# EAGLE schematic ArduTS-v1 (EAGLE 5.07)
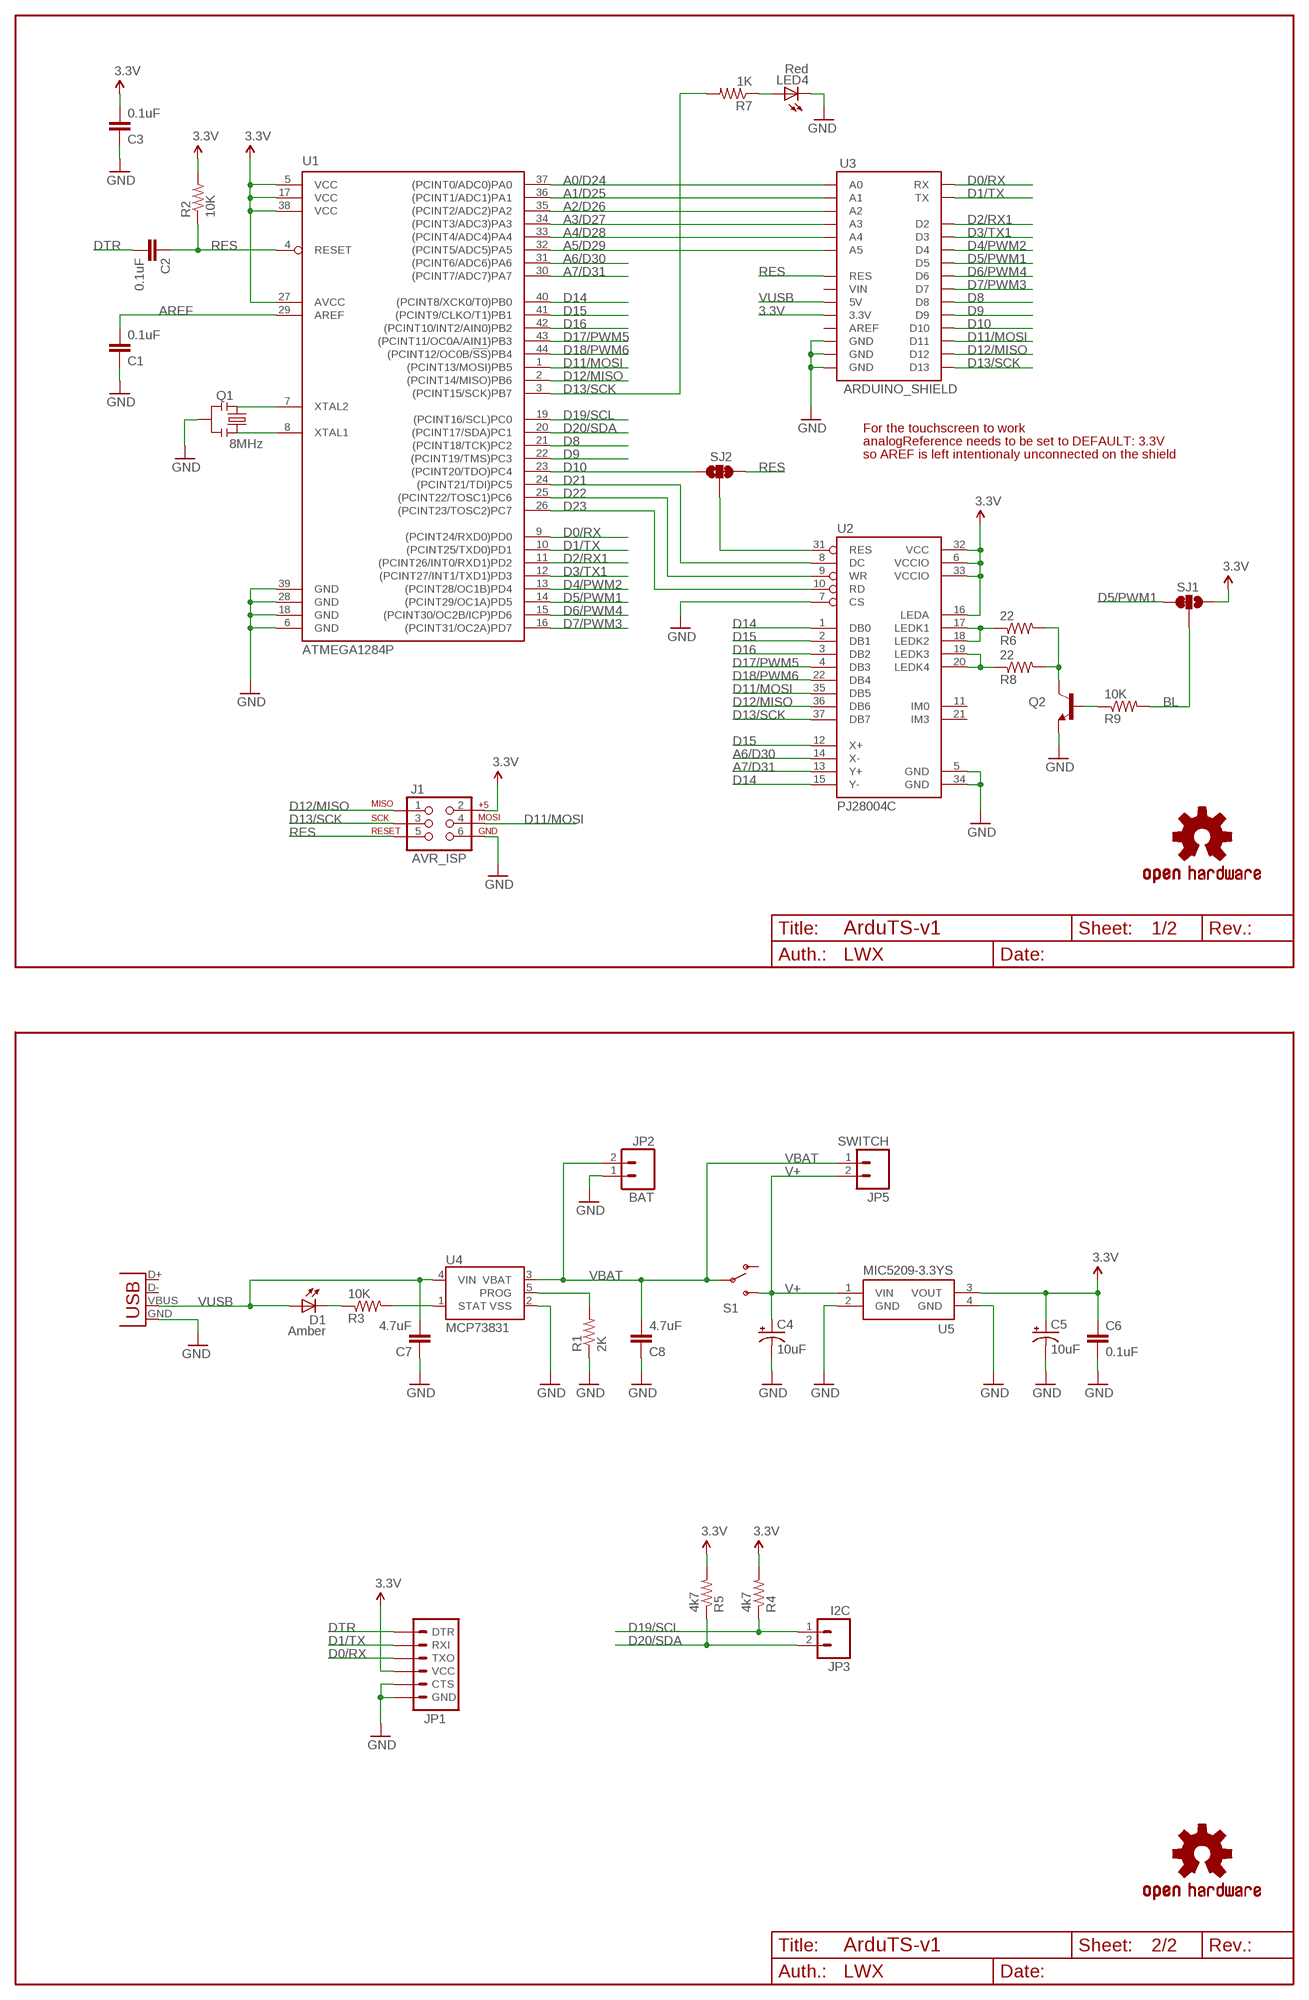
[diagram p0: schematic, sheet 1]

## Parts
C1  0.1uF  CAP0805  [0805]
C2  0.1uF  CAP0805  [0805]
C3  0.1uF  CAP0805  [0805]
C4  10uF  CAP_POL1206  [EIA3216]
C5  10uF  CAP_POL1206  [EIA3216]
C6  0.1uF  CAP0805  [0805]
C7  4.7uF  CAP0805  [0805]
C8  4.7uF  CAP0805  [0805]
D1  Amber  LED  [LED]
J1  AVR_ISP  AVR_SPI_PRG_6PTH  [2X3]
JP1  ARDUINO_SERIAL_PROGRAMPTH  [1X06]
JP2  BAT  M02-JST-2MM-SMT  [JST-2-SMD]
JP3  I2C  M02  [1X02]
JP5  SWITCH  M02  [1X02]
LED4  Red  LED805  [LED-0805]
Q1  8MHz  RESONATORSMD  [RESONATOR-SMD]
Q2  TRANSISTOR_NPNSOT23-3  [SOT23-3]
R1  2K  RESISTOR0805-RES  [0805]
R2  10K  RESISTOR0805-RES  [0805]
R3  10K  RESISTOR0805-RES  [0805]
R4  4k7  RESISTOR0805-RES  [0805]
R5  4k7  RESISTOR0805-RES  [0805]
R6  22  RESISTOR0805-RES  [0805]
R7  1K  RESISTOR0805-RES  [0805]
R8  22  RESISTOR0805-RES  [0805]
R9  10K  RESISTOR0805-RES  [0805]
S1  SWITCH-SPST-SMD-A  [SWITCH-SPST-SMD-A]
SJ1  SJ_2WAYS_1-2  [SJ_2WAYS_1-2_S]
SJ2  SJ_2WAYS_1-2  [SJ_2WAYS_1-2_S]
U1  ATMEGA1284P  ATMEGA324A  [TQFP44]
U2  PJ28004C  [PJ28004C]
U3  ARDUINO_SHIELD  [ARDUINO_SHIELD]
U4  MCP73831  [SOT23-5]
U5  MIC5209-3.3YS  MIC5209  [SOT223]
U$3  OSHW-LOGOM  [OSHW-LOGO-M]
U$5  OSHW-LOGOM  [OSHW-LOGO-M]
X1  USBSMD  [USB-MINIB]

## Nets
3.3V: C3.2 C5.A(+) C6.1 J1.2 JP1.4(VCC) R2.2 R4.2 R5.2 SJ1.3 U1.5(VCC) U1.17(VCC) U1.27(AVCC) U1.38(VCC) U2.6(VCCIO) U2.16(LEDA) U2.32(VCC) U2.33(VCCIO) U3.3.3V U5.3(VOUT)
A0/D24: U1.37((PCINT0/ADC0)PA0) U3.A0
A1/D25: U1.36((PCINT1/ADC1)PA1) U3.A1
A2/D26: U1.35((PCINT2/ADC2)PA2) U3.A2
A3/D27: U1.34((PCINT3/ADC3)PA3) U3.A3
A4/D28: U1.33((PCINT4/ADC4)PA4) U3.A4
A5/D29: U1.32((PCINT5/ADC5)PA5) U3.A5
A6/D30: U1.31((PCINT6/ADC6)PA6) U2.14(X-)
A7/D31: U1.30((PCINT7/ADC7)PA7) U2.13(Y+)
AREF: C1.2 U1.29(AREF)
BL: R9.2 SJ1.2
D0/RX: JP1.3(TXO) U1.9((PCINT24/RXD0)PD0) U3.RX
D1/TX: JP1.2(RXI) U1.10((PCINT25/TXD0)PD1) U3.TX
D2/RX1: U1.11((PCINT26/INT0/RXD1)PD2) U3.D2
D3/TX1: U1.12((PCINT27/INT1/TXD1)PD3) U3.D3
D4/PWM2: U1.13((PCINT28/OC1B)PD4) U3.D4
D5/PWM1: SJ1.1 U1.14((PCINT29/OC1A)PD5) U3.D5
D6/PWM4: U1.15((PCINT30/OC2B/ICP)PD6) U3.D6
D7/PWM3: U1.16((PCINT31/OC2A)PD7) U3.D7
D8: U1.21((PCINT18/TCK)PC2) U3.D8
D9: U1.22((PCINT19/TMS)PC3) U3.D9
D10: SJ2.3 U1.23((PCINT20/TDO)PC4) U3.D10
D11/MOSI: J1.4 U1.1((PCINT13/MOSI)PB5) U2.35(DB5) U3.D11
D12/MISO: J1.1 U1.2((PCINT14/MISO)PB6) U2.36(DB6) U3.D12
D13/SCK: J1.3 R7.2 U1.3((PCINT15/SCK)PB7) U2.37(DB7) U3.D13
D14: U1.40((PCINT8/XCK0/T0)PB0) U2.1(DB0) U2.15(Y-)
D15: U1.41((PCINT9/CLKO/T1)PB1) U2.2(DB1) U2.12(X+)
D16: U1.42((PCINT10/INT2/AIN0)PB2) U2.3(DB2)
D17/PWM5: U1.43((PCINT11/OC0A/AIN1)PB3) U2.4(DB3)
D18/PWM6: U1.44((PCINT12/OC0B/!SS!)PB4) U2.22(DB4)
D19/SCL: JP3.1 R4.1 U1.19((PCINT16/SCL)PC0)
D20/SDA: JP3.2 R5.1 U1.20((PCINT17/SDA)PC1)
D21: U1.24((PCINT21/TDI)PC5) U2.8(DC)
D22: U1.25((PCINT22/TOSC1)PC6) U2.9(WR)
D23: U1.26((PCINT23/TOSC2)PC7) U2.10(RD)
DTR: C2.2 JP1.1(DTR)
GND [vcc]: C1.1 C3.1 C4.C(-) C5.C(-) C6.2 C7.1 C8.1 J1.6 JP1.5(CTS) JP1.6(GND) JP2.1 LED4.2(C) Q1.2 Q2.2(E) R1.1 U1.6(GND) U1.18(GND) U1.28(GND) U1.39(GND) U2.5(GND) U2.7(CS) U2.34(GND) U3.GND@0(GND) U3.GND@1(GND) U3.GND@2(GND) U4.2(VSS) U5.2(GND) U5.4(GND) X1.GND
N$1: Q1.1 U1.8(XTAL1)
N$2: Q1.3 U1.7(XTAL2)
N$3: SJ2.2 U2.31(RES)
N$4: Q2.1(B) R9.1
N$5: LED4.1(A) R7.1
N$7: Q2.3(C) R6.2 R8.2
N$8: D1.C1(C) R3.1
N$12: R3.2 U4.1(STAT)
N$13: R1.2 U4.5(PROG)
N$25: R8.1 U2.19(LEDK3) U2.20(LEDK4)
N$32: R6.1 U2.17(LEDK1) U2.18(LEDK2)
RES: C2.1 J1.5 R2.1 SJ2.1 U1.4(RESET) U3.RES
V+: C4.A(+) JP5.2 S1.3(S) U5.1(VIN)
VBAT: C8.2 JP2.2 JP5.1 S1.2(P) U4.3(VBAT)
VUSB: C7.2 D1.A1(A) U3.5V U4.4(VIN) X1.VBUS
Unconnected: S1.1(O) U2.11(IM0) U2.21(IM3) U3.AREF U3.VIN X1.D+ X1.D-

## Notes on the sheet
- For the touchscreen to work
- analogReference needs to be set to DEFAULT: 3.3V
- so AREF is left intentionaly unconnected on the shield
- 1/2
- LWX
- 2/2
- LWX

## Library data of the parts
C1-C3 C6-C8 = SparkFun:CAP: Capacitor Standard 0603 ceramic capacitor, and 0.1" leaded capacitor.
C4 C5 = SparkFun:CAP_POL: Capacitor Polarized These are standard SMD and PTH capacitors. Normally 10uF, 47uF, and 100uF in electrolytic and tantalum varieties. Always verify the external diameter of the through hole cap, it varies with capacity, voltage, and manufacturer. The EIA devices should be standard.
D1 LED4 = wibauxl:LED
J1 = SparkFun:AVR_SPI_PRG_6: AVR ISP 6 Pin This is the reduced ISP connector for AVR programming. Common on Arduino. This footprint will take up less PCB space and can be used with a 10-pin to 6-pin adapter such as SKU: BOB-08508
JP1 = SparkFun:ARDUINO_SERIAL_PROGRAM
JP2 = SparkFun:M02: Header 2 Standard 2-pin 0.1" header. Use with straight break away headers (SKU : PRT-00116), right angle break away headers (PRT-00553), swiss pins (PRT-00743), machine pins (PRT-00117), and female headers (PRT-00115). Molex polarized connector foot print use with SKU : PRT-08233 with associated crimp pins and housings.
JP3 JP5 = wibauxl:M02
Q1 = SparkFun:RESONATOR: Resonator Small SMD resonator. This is the itty bitty 10/20MHz resonators with built in caps. CSTCE10M0G55 and CSTCE20M0V53. Footprint has been reviewed closely but hasn't been tested yet.
Q2 = SparkFun:TRANSISTOR_NPN: Transistor NPN BJT configuration in SOT23 package. MMBT2222 is the common NPN we use. Double check BCE configuration again layout.
R1-R9 = SparkFun:RESISTOR: Resistor Basic schematic elements and footprints for 0603, 1206, and PTH resistors.
S1 = SparkFun:SWITCH-SPST: SPST Switch Simple slide switch. Spark Fun Electronics SKU : COM-00102
SJ1 SJ2 = wibauxl:SJ_2WAYS_1-2
U1 = wibauxl:ATMEGA324: 8-bit Microcontroller with 64K Bytes In-System Programmable Flash Source: http://www.atmel.com/dyn/resources/prod_documents/doc2593.pdf
U2 = wibauxl:PJ28004C
U3 = wibauxl:ARDUINO_SHIELD
U4 = SparkFun:MCP73831: Microchip's MCP73831 Miniature single cell, fully integrated Li-Ion, Li-polymer charge management controller http://ww1.microchip.com/downloads/en/DeviceDoc/21984a.pdf
U5 = wibauxl:MIC5209
U$3 U$5 = SparkFun:OSHW-LOGO: Open Source Hardware Logo This logo indicates the piece of hardware it is found on incorporates a OSHW license and/or adheres to the definition of open source hardware found here: http://freedomdefined.org/OSHW
X1 = SparkFun:USB: USB Connectors USB-B-PTH is fully proven SKU : PRT-00139 USB-miniB is fully proven SKU : PRT-00587 USB-A-PCB is untested. USB-A-H is throughly reviewed, but untested. Spark Fun Electronics SKU : PRT-00437 USB-B-SMT is throughly reviewed, but untested. Needs silkscreen touching up. USB-A-S has not been used/tested USB-MB-H has not been used/tested

## Net classes
0 default: width 0.203 mm
1 vcc: width 0.254 mm